# Altium schematic sheet QB50NZSolarArray.SchDoc
size A4
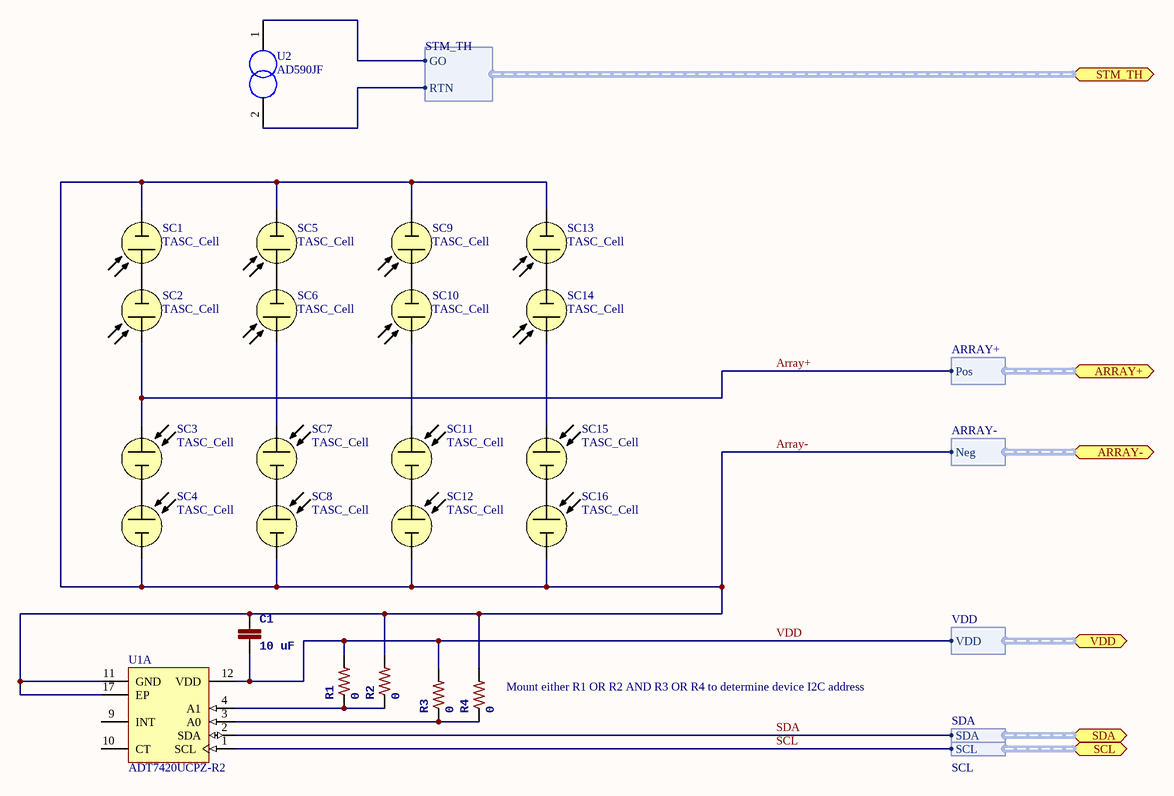
[diagram p0: QB50NZSolarArray.SchDoc]

## Parts
C1  10 uF  [0805]
R1  0  [0805]
R2  0  [0805]
R3  0  [0805]
R4  0  [0805]
SC1  TASC_Cell  [TASC Solar Cell]
SC2  TASC_Cell  [TASC Solar Cell]
SC3  TASC_Cell  [TASC Solar Cell]
SC4  TASC_Cell  [TASC Solar Cell]
SC5  TASC_Cell  [TASC Solar Cell]
SC6  TASC_Cell  [TASC Solar Cell]
SC7  TASC_Cell  [TASC Solar Cell]
SC8  TASC_Cell  [TASC Solar Cell]
SC9  TASC_Cell  [TASC Solar Cell]
SC10  TASC_Cell  [TASC Solar Cell]
SC11  TASC_Cell  [TASC Solar Cell]
SC12  TASC_Cell  [TASC Solar Cell]
SC13  TASC_Cell  [TASC Solar Cell]
SC14  TASC_Cell  [TASC Solar Cell]
SC15  TASC_Cell  [TASC Solar Cell]
SC16  TASC_Cell  [TASC Solar Cell]
U1  ADT7420UCPZ-R2  [ADI-CP-16-17_L]  (part A of 2)
U2  AD590JF  [AD590JF]

## Ports
ARRAY+ (harness ARRAY+), ARRAY- (harness ARRAY-), SCL (harness SCL), SDA (harness SDA), STM_TH (harness STM_TH), VDD (harness VDD)

## Harnesses
ARRAY+: Pos
ARRAY-: Neg
VDD: VDD
SDA: SDA
SCL: SCL
STM_TH: GO, RTN

## Nets
Array+: SC2.Pos(+) SC3.Pos(+) ; port ARRAY+.Pos
Array-: C1.1 R2.2 R4.2 SC1.Neg(-) SC4.Neg(-) SC5.Neg(-) SC8.Neg(-) SC9.Neg(-) SC12.Neg(-) SC13.Neg(-) SC16.Neg(-) U1.11(GND) U1.17(EP) ; port ARRAY-.Neg
SCL: U1.1(SCL) ; port SCL.SCL
SDA: U1.2(SDA) ; port SDA.SDA
VDD: C1.2 R1.2 R3.2 U1.12(VDD) ; port VDD.VDD
NetR1_1: R1.1 R2.1 U1.4(A1)
NetR3_1: R3.1 R4.1 U1.3(A0)
NetSC1_Pos: SC1.Pos(+) SC2.Neg(-)
NetSC3_Neg: SC3.Neg(-) SC4.Pos(+)
NetSC5_Pos: SC5.Pos(+) SC6.Neg(-)
NetSC6_Pos: SC6.Pos(+) SC7.Pos(+)
NetSC7_Neg: SC7.Neg(-) SC8.Pos(+)
NetSC9_Pos: SC9.Pos(+) SC10.Neg(-)
NetSC10_Pos: SC10.Pos(+) SC11.Pos(+)
NetSC11_Neg: SC11.Neg(-) SC12.Pos(+)
NetSC13_Pos: SC13.Pos(+) SC14.Neg(-)
NetSC14_Pos: SC14.Pos(+) SC15.Pos(+)
NetSC15_Neg: SC15.Neg(-) SC16.Pos(+)
NetU2_1: U2.1 ; port STM_TH.GO
NetU2_2: U2.2 ; port STM_TH.RTN

Not connected (* = marked no-connect by the designer): U1 9(INT) 10(CT)

## Notes on the sheet
- (near R4) Mount either R1 OR R2 AND R3 OR R4 to determine device I2C address

## Library data of the parts
C1 = CAP0805_10uF: Tolerance: ±10%; Voltage - Rated: 10V; Temperature Coefficient: X5R; RoHS: RoHS Compliant; Category: Capacitors; Packaging: Tape & Reel (TR); Mounting Type: Surface Mount, MLCC; Operating Temperature: -55°C ~ 125°C; Applications: General Purpose; Ratings: -; Package / Case: 0805 (2012 Metric); Size / Dimension: 0.079" L x 0.049" W (2.00mm x 1.25mm); Thickness (Max): 0.039" (1.00mm); Value: 10 uF; Supplier 1: Digi-Key; Supplier Part Number 1: 445-7660-1-ND
R1-R4 = RES_0805_0: Manufacturer: TE Connectivity; Manufacturer Part Number: 1625856-2; Resistance (Ohms): 100M; Tolerance: ±10%; Power (Watts): 0.125W, 1/8W; Temperature Coefficient: ±100ppm/°C; RoHS: RoHS Compliant; Category: Resistors; Packaging: Cut Tape (CT); Composition: Thick Film; Features: -; Operating Temperature: -55°C ~ 125°C; Package / Case: 0805 (2012 Metric); Supplier Device Package: 0805; Size / Dimension: 0.079" L x 0.047" W (2.00mm x 1.20mm); Height: 0.020" (0.50mm); Number of Terminations: 2; ComponentLink1URL: http://www.te.com/commerce/DocumentDelivery/DDEController?Action=srchrtrv&DocNm=1625856&DocType=Customer+Drawing&DocLang=English; ComponentLink1Description: http://www.te.com/commerce/DocumentDelivery/DDEController?Action=srchrtrv&DocNm=1625856&DocType=Customer+Drawing&DocLang=English; Value: 0; Supplier 1: Digi-Key; Supplier Part Number 1: RHM0.0ARCT-ND
U1 = CMP-0886-00002-1: +/-0.25 Deg Accurate, 16-Bit Digital I2C Temperature Sensor, 2.7 to 5.5 V Supply, Industrial, 16-pin QFN (CP-16-17), Reel; Manufacturer: Analog Devices; ComponentLink3URL: http://www.analog.com/static/imported-files/packages/PKG_PDF/LFCSP(CP)/CP_16_17.pdf; ComponentLink1URL: http://www.analog.com/en/index.html; ComponentLink3Description: Package Specification; ComponentLink4URL: http://www.analog.com/en/mems-sensors/digital-temperature-sensors/adt7420/products/product.html; ComponentLink2URL: http://www.analog.com/static/imported-files/data_sheets/ADT7420.pdf; DatasheetVersion: Rev. 0; PartNumber: ADT7420UCPZ-R2; PackageVersion: 08-16-2010-C; Mounting Technology: Surface Mount; Packing: Reel; PackageDescription: 16-Pin Lead Frame Chip Scale Package, Body 4 x 4 mm, Pitch 0.65 mm; ComponentLink4Description: Product URL; Code_JEDEC: MO-220-WGGC; ComponentLink1Description: Manufacturer URL; Supply Voltage Range: 2.7 to 5.5 V; ComponentLink2Description: Datasheet; PackageReference: CP-16-17
U2 = AD590JF: Supplier 1: Digi-Key; Supplier Part Number 1: AD590JF-ND